# EAGLE schematic supply (EAGLE 6.6.0)
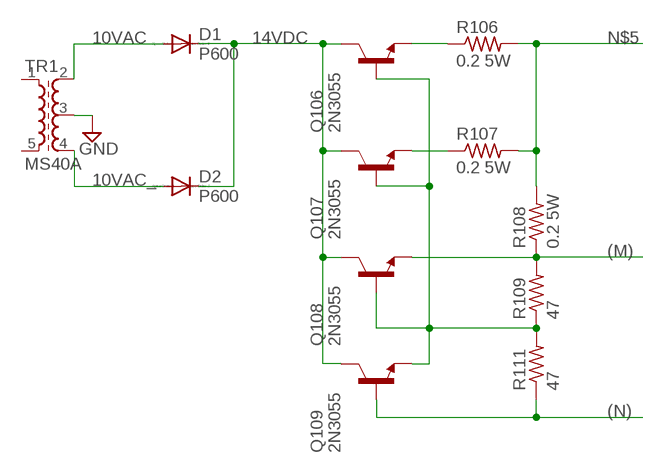
[diagram p0: schematic, sheet 1]

## Parts
D1  P600  [P6-15]
D2  P600  [P6-15]
Q106  2N3055  [TO3]
Q107  2N3055  [TO3]
Q108  2N3055  [TO3]
Q109  2N3055  [TO3]
R106  0.2 5W  R-US_0617/17  [0617/17]
R107  0.2 5W  R-US_0617/17  [0617/17]
R108  0.2 5W  R-US_0617/17  [0617/17]
R109  47  R-US_0207/10  [0207/10]
R111  47  R-US_0207/10  [0207/10]
TR1  MS40A  [MS40]

## Nets
10VAC: D1.A TR1.2
10VAC_: D2.A TR1.4
14VDC: D1.C D2.C Q106.C Q106.C/(C) Q107.C Q107.C/(C) Q108.C Q108.C/(C) Q109.C Q109.C/(C)
(M): Q108.E R108.1 R109.2
(N): Q109.B R111.1
GND: TR1.3
N$2: Q106.B Q107.B Q108.B Q109.E R109.1 R111.2
N$3: Q106.E R106.1
N$5: R106.2 R107.2 R108.2
N$6: Q107.E R107.1
Unconnected: TR1.1 TR1.5

## Library data of the parts
D1 D2 = diode:P600: DIODE high voltage diode, silicon rectifier 1.0 A to 6.0 A, 50 V to 1300 V http://www.kosemi.com/product/diosr.html
Q106-Q109 = transistor-npn:2N3055: NPN Transistor
R106-R109 R111 = rcl:R-US_: RESISTOR, American symbol
TR1 = inductor-neosid:MS40: TRANSFORMER SMD transformer acc. to customer specification; OC_FARNELL: unknown; OC_NEWARK: unknown